# EasyEDA Pro project ProPrj_药盒0.11_2025-04-15.epro, board PCB_8266ex-20241025-smt_2025-03-07
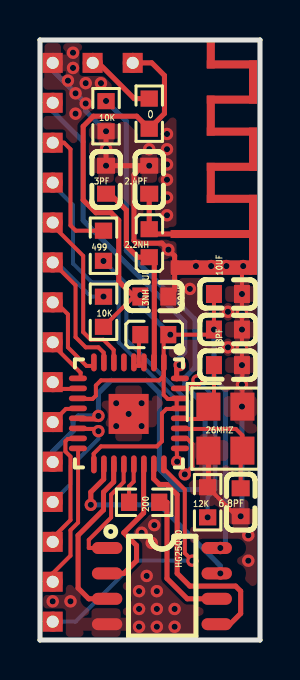
[diagram p5: board, top side]
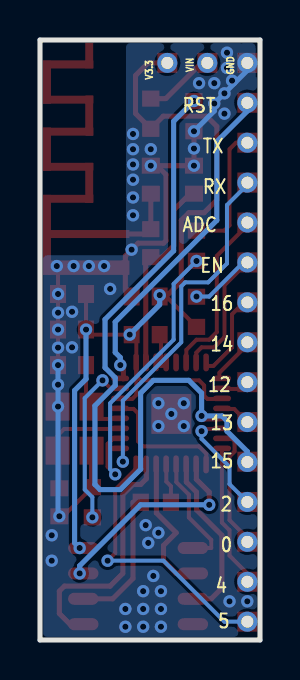
[diagram p6: board, bottom side, seen from below]

Outline 11 x 30 mm; copper layers: Top Layer, Bottom Layer. Coordinates in mm from the lower left corner of the outline.
Outline path: 0,30 11,30 11,0 0,0 0,30
Stack: Top Layer 0.035mm / Dielectric1 1.51mm FR4 er 4.5 / Bottom Layer 0.035mm

## Design rules (mm)
spacing safeClearance (default): track to track 0.152, other pairs 0.152 to 0.3
track width trackWidth (default): min 0.127, default 0.254, max 2.54
differential pair differentialPair (default): width min 0.127, default 0.254, max 2.54; gap min 0.152, default 0.152
via viaSize (default): diameter min 0.5, default 0.61, max 10; hole min 0.3, default 0.305, max 6
pour e73 uses gge48863
pour e346 uses gge48839

## Placement (name value [footprint] x y rotation side)
0  -  [R0603]  5.46 26.32 270 top
1UF  -  [C0603]  5.72 17.17 0 top
2.2NH  -  [IND-SMD_L1.6-W0.8-1]  5.46 19.84 270 top
2.4PF  -  [C0603]  5.46 23.02 270 top
3PF  -  [C0603]  3.3 23.02 270 top
4.3NH  -  [L0603]  5.72 15.27 0 top
6.8PF  -  [C0603]  9.4 13.74 0 top
6.8PF#2  -  [C0603]  10.03 6.89 270 top
10K  -  [R0603]  3.3 26.19 270 top
10K#2  -  [R0603]  3.17 16.41 270 top
10UF  -  [C0603]  9.4 17.3 0 top
12K  -  [R0603]  8.38 6.89 270 top
26MHZ  -  [CRYSTAL-SMD_4P-L3.2-W2.5-BL]  9.27 10.57 270 top
100NF  -  [C0603]  9.4 15.52 0 top
200  -  [R0603]  5.21 6.89 0 top
499  -  [R0603]  3.17 19.71 270 top
ANT2  -  [ANTENNA-2.4GHZ-MEANTRED]  6.73 19.46 270 top
HG25Q80  -  [SOP-8_L5.0-W3.9-P1.27-LS6.0-BL]  6.1 2.69 270 top
NOREF  -  [Pad_e367]  1.89 12.58 180 top
NOREF#2  -  [Pad_e541]  4.63 28.86 90 top
NOREF#3  -  [Pad_e335]  0.63 12.89 90 top
NOREF#4  -  [Pad_e539]  0.63 28.86 90 top
NOREF#5  -  [Pad_e331]  0.63 14.89 90 top
NOREF#6  -  [Pad_e373]  1.89 9.58 180 top
NOREF#7  -  [Pad_e342]  0.63 28.86 90 top
NOREF#8  -  [Pad_e377]  4.2 8.78 180 top
NOREF#9  -  [Pad_e380]  5.69 8.78 180 top
NOREF#10  -  [Pad_e525]  0.63 20.87 0 top
NOREF#11  -  [Pad_e343]  4.43 11.3 270 top
NOREF#12  -  [Pad_e341]  0.63 26.86 90 top
NOREF#13  -  [Pad_e368]  1.89 12.08 180 top
NOREF#14  -  [Pad_e340]  0.63 4.91 90 top
NOREF#15  -  [Pad_e339]  0.63 22.87 90 top
NOREF#16  -  [Pad_e330]  0.63 16.88 90 top
NOREF#17  -  [Pad_e378]  4.69 8.78 180 top
NOREF#18  -  [Pad_e527]  0.63 16.88 0 top
NOREF#19  -  [Pad_e361]  4.69 13.88 180 top
NOREF#20  -  [Pad_e376]  3.7 8.78 180 top
NOREF#21  -  [Pad_e534]  0.63 0.92 0 top
NOREF#22  -  [Pad_e383]  7 10.08 180 top
NOREF#23  -  [Pad_e365]  2.69 13.88 180 top
NOREF#24  -  [Pad_e538]  0.63 26.86 0 top
NOREF#25  -  [Pad_e382]  7 9.58 180 top
NOREF#26  -  [Pad_e328]  0.63 20.87 90 top
NOREF#27  -  [Pad_e344]  2.63 28.86 90 top
NOREF#28  -  [Pad_e360]  5.19 13.88 180 top
NOREF#29  -  [Pad_e535]  0.63 24.87 0 top
NOREF#30  -  [Pad_e357]  7 13.08 180 top
NOREF#31  -  [Pad_e387]  7 12.08 180 top
NOREF#32  -  [Pad_e336]  0.63 2.91 90 top
NOREF#33  -  [Pad_e532]  0.63 12.89 0 top
NOREF#34  -  [Pad_e345]  4.63 28.86 90 top
NOREF#35  -  [Pad_e386]  7 11.58 180 top
NOREF#36  -  [Pad_e369]  1.89 11.58 180 top
NOREF#37  -  [Pad_e358]  6.19 13.88 180 top
NOREF#38  -  [Pad_e528]  0.63 14.89 0 top
NOREF#39  -  [Pad_e333]  0.63 8.92 90 top
NOREF#40  -  [Pad_e374]  2.69 8.78 180 top
NOREF#41  -  [Pad_e338]  0.63 24.87 90 top
NOREF#42  -  [Pad_e329]  0.63 18.88 90 top
NOREF#43  -  [Pad_e384]  7 10.58 180 top
NOREF#44  -  [Pad_e533]  0.63 2.91 0 top
NOREF#45  -  [Pad_e364]  3.2 13.88 180 top
NOREF#46  -  [Pad_e372]  1.89 10.08 180 top
NOREF#47  -  [Pad_e388]  7 12.58 180 top
NOREF#48  -  [Pad_e332]  0.63 6.9 90 top
NOREF#49  -  [Pad_e334]  0.63 10.9 90 top
NOREF#50  -  [Pad_e371]  1.89 10.58 180 top
NOREF#51  -  [Pad_e366]  1.89 13.08 180 top
NOREF#52  -  [Pad_e536]  0.63 22.87 0 top
NOREF#53  -  [Pad_e385]  7 11.08 180 top
NOREF#54  -  [Pad_e530]  0.63 8.9 0 top
NOREF#55  -  [Pad_e362]  4.2 13.88 180 top
NOREF#56  -  [Pad_e529]  0.63 6.9 0 top
NOREF#57  -  [Pad_e337]  0.63 0.92 90 top
NOREF#58  -  [Pad_e537]  0.63 4.91 0 top
NOREF#59  -  [Pad_e381]  6.19 8.78 180 top
NOREF#60  -  [Pad_e363]  3.7 13.88 180 top
NOREF#61  -  [Pad_e375]  3.2 8.78 180 top
NOREF#62  -  [Pad_e526]  0.63 18.88 0 top
NOREF#63  -  [Pad_e531]  0.63 10.9 0 top
NOREF#64  -  [Pad_e540]  2.63 28.86 90 top
NOREF#65  -  [Pad_e370]  1.89 11.08 180 top
NOREF#66  -  [Pad_e359]  5.69 13.88 180 top
NOREF#67  -  [Pad_e379]  5.19 8.78 180 top

## Footprints (pads in the part's own frame, mm; a bottom-side part is the same pattern mirrored in y, then rotated)
ANTENNA-2.4GHZ-MEANTRED
  rect 0.4x0.4 smd: 1(-0.84,0)
  rect 0.72x0.4 smd: 2(0.84,0)
C0603
  rect 0.8x0.9 smd: 1(-0.7,0) 2(0.7,0)
CRYSTAL-SMD_4P-L3.2-W2.5-BL
  rect 1.4x1.2 smd: 1(-1.1,-0.85) 2(1.1,-0.85) 3(1.1,0.85) 4(-1.1,0.85)
IND-SMD_L1.6-W0.8-1
  rect 0.8x0.864 smd: 1(0.7,0) 2(-0.7,0)
L0603
  rect 0.8x0.864 smd: 1(-0.7,0) 2(0.7,0)
Pad_e328
  rect 1x1 smd: 1(0,0)
Pad_e329
  rect 1x1 smd: 1(0,0)
Pad_e330
  rect 1x1 smd: 1(0,0)
Pad_e331
  rect 1x1 smd: 1(0,0)
Pad_e332
  rect 1x1 smd: 1(0,0)
Pad_e333
  rect 1x1 smd: 1(0,0)
Pad_e334
  rect 1x1 smd: 1(0,0)
Pad_e335
  rect 1x1 smd: 1(0,0)
Pad_e336
  rect 1x1 smd: 1(0,0)
Pad_e337
  rect 1x1 smd: 1(0,0)
Pad_e338
  rect 1x1 smd: 1(0,0)
Pad_e339
  rect 1x1 smd: 1(0,0)
Pad_e340
  rect 1x1 smd: 1(0,0)
Pad_e341
  rect 1x1 smd: 1(0,0)
Pad_e342
  rect 1x1 smd: 1(0,0)
Pad_e343
  rect 2x2 smd: 33(0,0)
Pad_e344
  rect 1x1 smd: 1(0,0)
Pad_e345
  rect 1x1 smd: 1(0,0)
Pad_e357
  oval 0.9x0.28 smd: 32(0,0)
Pad_e358
  oval 0.28x0.9 smd: 1(0,0)
Pad_e359
  oval 0.28x0.9 smd: 2(0,0)
Pad_e360
  oval 0.28x0.9 smd: 3(0,0)
Pad_e361
  oval 0.28x0.9 smd: 4(0,0)
Pad_e362
  oval 0.28x0.9 smd: 5(0,0)
Pad_e363
  oval 0.28x0.9 smd: 6(0,0)
Pad_e364
  oval 0.28x0.9 smd: 7(0,0)
Pad_e365
  oval 0.28x0.9 smd: 8(0,0)
Pad_e366
  oval 0.9x0.28 smd: 9(0,0)
Pad_e367
  oval 0.9x0.28 smd: 10(0,0)
Pad_e368
  oval 0.9x0.28 smd: 11(0,0)
Pad_e369
  oval 0.9x0.28 smd: 12(0,0)
Pad_e370
  oval 0.9x0.28 smd: 13(0,0)
Pad_e371
  oval 0.9x0.28 smd: 14(0,0)
Pad_e372
  oval 0.9x0.28 smd: 15(0,0)
Pad_e373
  oval 0.9x0.28 smd: 16(0,0)
Pad_e374
  oval 0.28x0.9 smd: 17(0,0)
Pad_e375
  oval 0.28x0.9 smd: 18(0,0)
Pad_e376
  oval 0.28x0.9 smd: 19(0,0)
Pad_e377
  oval 0.28x0.9 smd: 20(0,0)
Pad_e378
  oval 0.28x0.9 smd: 21(0,0)
Pad_e379
  oval 0.28x0.9 smd: 22(0,0)
Pad_e380
  oval 0.28x0.9 smd: 23(0,0)
Pad_e381
  oval 0.28x0.9 smd: 24(0,0)
Pad_e382
  oval 0.9x0.28 smd: 25(0,0)
Pad_e383
  oval 0.9x0.28 smd: 26(0,0)
Pad_e384
  oval 0.9x0.28 smd: 27(0,0)
Pad_e385
  oval 0.9x0.28 smd: 28(0,0)
Pad_e386
  oval 0.9x0.28 smd: 29(0,0)
Pad_e387
  oval 0.9x0.28 smd: 30(0,0)
Pad_e388
  oval 0.9x0.28 smd: 31(0,0)
Pad_e525
  round 1 hole 0.6: 1(0,0)
Pad_e526
  round 1 hole 0.6: 1(0,0)
Pad_e527
  round 1 hole 0.6: 1(0,0)
Pad_e528
  round 1 hole 0.6: 1(0,0)
Pad_e529
  round 1 hole 0.6: 1(0,0)
Pad_e530
  round 1 hole 0.6: 1(0,0)
Pad_e531
  round 1 hole 0.6: 1(0,0)
Pad_e532
  round 1 hole 0.6: 1(0,0)
Pad_e533
  round 1 hole 0.6: 1(0,0)
Pad_e534
  round 1 hole 0.6: 1(0,0)
Pad_e535
  round 1 hole 0.6: 1(0,0)
Pad_e536
  round 1 hole 0.6: 1(0,0)
Pad_e537
  round 1 hole 0.6: 1(0,0)
Pad_e538
  round 1 hole 0.6: 1(0,0)
Pad_e539
  round 1 hole 0.6: 1(0,0)
Pad_e540
  round 1 hole 0.6: 1(0,0)
Pad_e541
  round 1 hole 0.6: 1(0,0)
R0603
  rect 0.806x0.864 smd: 1(-0.753,0) 2(0.753,0)
SOP-8_L5.0-W3.9-P1.27-LS6.0-BL
  oval 0.6x1.52 smd: 1(-1.905,-2.74) 2(-0.635,-2.74) 3(0.635,-2.74) 4(1.905,-2.74) 5(1.905,2.74) 6(0.635,2.74) 7(-0.635,2.74) 8(-1.905,2.74)

## Nets
GND: 1UF.2 2.4PF.1 3PF.1 6.8PF.2 6.8PF#2.2 10K.2 10UF.2 12K.1 26MHZ.2 26MHZ.4 100NF.2 ANT2.2 HG25Q80.4 NOREF#4.1 NOREF#7.1 NOREF#11.33
V3: 0.2 1UF.1 4.3NH.2 10K#2.2 10UF.1 100NF.1 HG25Q80.8 NOREF#2.1 NOREF#13.11 NOREF#31.30 NOREF#34.1 NOREF#35.29 NOREF#37.1 NOREF#40.17
VIN: 0.1 NOREF#27.1 NOREF#64.1
2: 2.2NH.1 3PF.2
3: 4.3NH.1 NOREF#19.4
20SCS: HG25Q80.1 NOREF#8.20
21: 200.1
26: 499.2
27: 6.8PF#2.1 26MHZ.3
28: 6.8PF.1 26MHZ.1
31: 12K.2 NOREF#47.31
ADC: NOREF#10.1 NOREF#26.1 NOREF#60.6
ANT: 2.2NH.2 2.4PF.2 ANT2.1
D: NOREF#67.22
D0: HG25Q80.2
D1: HG25Q80.5 NOREF#9.23
EN: 10K#2.1 NOREF#42.1 NOREF#45.7 NOREF#62.1
GPIO0: NOREF#14.1 NOREF#46.15 NOREF#58.1
GPIO2: NOREF#48.1 NOREF#50.14 NOREF#56.1
GPIO4: NOREF#6.16 NOREF#32.1 NOREF#44.1
GPIO5: NOREF#21.1 NOREF#57.1 NOREF#59.24
GPIO9: HG25Q80.7 NOREF#61.18
GPIO10: HG25Q80.3 NOREF#20.19
GPIO12: NOREF.10 NOREF#3.1 NOREF#33.1
GPIO13: NOREF#36.12 NOREF#49.1 NOREF#63.1
GPIO14: NOREF#5.1 NOREF#38.1 NOREF#51.9
GPIO15: 10K.1 NOREF#39.1 NOREF#54.1 NOREF#65.13
GPIO16: NOREF#16.1 NOREF#18.1 NOREF#23.8
NRST: NOREF#12.1 NOREF#24.1 NOREF#30.32
RX: NOREF#15.1 NOREF#25.25 NOREF#52.1
SCLK: 200.2 HG25Q80.6
TX: 499.1 NOREF#29.1 NOREF#41.1

Pads without a net: NOREF#17 21; NOREF#22 26; NOREF#28 3; NOREF#43 27; NOREF#53 28; NOREF#55 5; NOREF#66 2

## Via types
v1: diameter 0.62, hole 0.31, Top Layer to Bottom Layer, 73 vias

## Routing (per net, layer and track width the routed paths; a pad name or vN(x,y) marks a point on that pad's centre or on a via; arc(x,y) is an arc through that point)
GND: length 40
  Top Layer w0.2: v1(10.03,6.19) 9.84,6.19 12K.1 ; v1(10.1,17.3) 10.1,18.38 9.86,18.62 ANT2.2 ; v1(10.1,17.3) v1(10.1,16.36) ; v1(10.1,17.3) v1(10.1,15.52) v1(10.1,14.62) v1(10.1,13.74) 10.12,13.72 26MHZ.4
  Top Layer w0.254: v1(5.46,23.72) v1(3.3,23.72) v1(3.3,24.57) v1(3.3,25.44) ; 12K.1 8.42,7.68 26MHZ.2 ; 5.46,23.72 5.15,23.72 4.7,23.27 4.7,19.97 4.83,19.84 6.1,19.84 v1(6.42,19.52) 6.73,19.2 ANT2.2 6.73,17.49 1UF.2
  Bottom Layer w0.254: v1(10.1,13.74) v1(10.1,12.77) 10.1,6.25 v1(10.03,6.19) ; 10K.2 2.29,26.45 v1(2.29,26.83) 0.63,28.48 NOREF#4.1
  vias: v1(0.63,1.93) v1(1.4,27.97) v1(1.52,1.93) v1(1.65,29.36) v1(1.65,28.6) v1(1.78,27.33) v1(1.78,26.32) v1(2.29,27.84) v1(3.05,27.84) v1(3.81,11.84) v1(3.81,10.7) v1(4.43,11.3) v1(4.95,2.44) v1(4.95,1.55) v1(4.95,0.66) v1(5.08,11.84) v1(5.08,10.7) v1(5.08,5.36) v1(5.33,3.2) v1(5.46,24.54) v1(5.59,4.85) v1(5.72,5.74) v1(5.84,2.44) v1(5.84,1.55) v1(5.84,0.66) v1(6.35,25.3) v1(6.35,24.54) v1(6.35,23.78) v1(6.35,23.02) v1(6.35,22.13) v1(6.35,21.24) v1(6.73,1.55) v1(6.73,0.66) v1(7.49,17.55) v1(7.8,18.7) v1(8.56,18.7) v1(9.32,18.7) v1(9.4,16.41) v1(9.4,14.63) v1(10.1,11.67) v1(10.16,18.7) v1(10.41,5.23) v1(10.41,3.97)
V3: length 55.6
  Top Layer w0.2: 6.83,12.05 6.39,12.05 6.18,12.26 6.18,13.7 ; 6.83,12.05 6.83,11.55 6.32,11.55 6.1,11.33 6.1,9.93 5.84,9.68 3.05,9.68 2.68,9.31 2.68,8.9 ; 6.18,13.7 6.18,14.94 v1(6.51,15.27) 8.44,15.27 v1(8.7,15.52) 10UF.1 ; 6.18,13.7 6.18,13.2 5.97,12.98 3.05,12.98 2.79,12.73 2.79,12.22 2.63,12.05 2.03,12.05 ; 1UF.1 4.69,17.17 10K#2.2
  Top Layer w0.254: 0.2 4.83,26.19 2.67,26.19 2.16,25.68 2.16,22 2.79,21.36 3.56,21.36 3.94,20.98 3.94,17.94 4.7,17.17 1UF.1 ; 0.2 6.22,26.33 6.22,28.22 5.59,28.86 NOREF#2.1 ; 0.2 5.46,25.44
  Bottom Layer w0.254: v1(9.02,4.6) 9.27,4.85 9.27,12.47 8.7,13.05 8.7,15.52 ; 5.02,17.24 5.02,16.77 v1(6.51,15.27)
  vias: v1(5.01,17.24)
VIN: length 3.6
  Top Layer w0.254: 0.1 4.71,27.07 2.92,28.86 2.63,28.86
2: length 10.3
  Top Layer w0.254: 5.72,13.62 5.72,19.14 2.2NH.1 4.89,19.14 4.32,19.71 4.32,21.49 3.49,22.32 3.3,22.32
3: length 2.1
  Top Layer w0.2: 4.68,13.7 5.19,13.72 ; 4.91,15.27 4.95,15.27 4.95,13.71
20SCS: length 5.9
  Top Layer w0.2: 3.3,4.6 2.44,4.6 2.44,5.01 3.56,6.12 3.56,7.27 4.18,7.89 4.18,8.9
21: length 2.1
  Top Layer w0.2: 4.68,8.9 4.68,7.92 4.45,7.69 200.1
26: length 15.1
  Top Layer w0.2: v1(7.24,8.28) 7.62,8.66 7.62,9.81 7.37,10.05 6.83,10.05
  Bottom Layer w0.2: v1(7.24,8.28) 7.49,8.54 7.49,11.84 4.32,15.01 4.32,17.81 v1(3.17,18.95)
27: length 6.2
  Top Layer w0.2: 6.83,10.55 9.79,10.55 10.12,10.23 26MHZ.3 ; 26MHZ.3 10.12,9.47 10.17,9.47 ; 26MHZ.3 10.03,9.38 6.8PF#2.1
28: length 4.4
  Top Layer w0.2: 6.83,11.05 8.1,11.05 8.42,11.37 26MHZ.1 8.7,11.67 8.7,13.74
31: length 8.6
  Top Layer w0.2: v1(7.87,12.98) 7.45,12.55 6.83,12.55
  Bottom Layer w0.2: v1(7.87,12.98) 8.76,12.09 8.76,7.52 8.38,7.14 12K.2
  vias: v1(8.38,6.13)
ADC: length 8.8
  Top Layer w0.2: NOREF#10.1 0.63,20.73 2.16,19.2 2.16,15.39 2.54,15.01 3.17,15.01 3.68,14.51 3.68,13.7
ANT: length 3.1
  Top Layer w0.254: 2.4PF.2 2.2NH.2 5.7,20.3 ANT2.1
D0: length 7.4
  Top Layer w0.254: 5.18,8.9 5.18,6.35 4.19,5.36 4.83,4.73 4.83,3.97 4.19,3.33 3.3,3.33
D1: length 12.2
  Top Layer w0.254: 5.68,8.9 5.68,8.06 5.97,7.78 6.35,7.78 6.86,7.27 6.86,3.33 7.49,2.69 9.78,2.69 10.03,2.44 10.03,1.32 9.5,0.79 9.02,0.79
EN: length 10.1
  Top Layer w0.2: 3.18,13.7 3.18,14.37 2.92,14.63 2.29,14.63 1.78,15.14 1.78,17.73 NOREF#42.1
  Bottom Layer w0.2: v1(3.17,17.17) 2.54,17.17 0.63,19.08 NOREF#42.1
GPIO0: length 6.3
  Top Layer w0.2: 0.63,4.91 0.63,5.11 1.52,6 1.52,9.17 1.27,9.43 1.27,9.93 1.39,10.05 2.03,10.05
GPIO2: length 5.4
  Top Layer w0.2: v1(2.92,10.44) 2.79,10.44 2.68,10.55 2.03,10.55
  Bottom Layer w0.2: v1(2.92,10.44) 2.92,10.06 1.52,8.66 1.52,7.79 NOREF#48.1
GPIO4: length 7.3
  Top Layer w0.2: NOREF#32.1 0.63,3.33 1.52,4.22 1.52,5.49 1.91,5.87 1.91,9.55 2.03,9.55
GPIO5: length 13.8
  Top Layer w0.2: 6.18,8.9 6.18,8.58 7.24,7.52 7.24,4.35 v1(7.62,3.97)
  Bottom Layer w0.2: v1(7.62,3.97) 4.83,3.97 1.78,0.92 NOREF#21.1
GPIO9: length 10.5
  Top Layer w0.254: 3.18,8.9 3.18,8.04 2.54,7.39 v1(2.54,6.76)
  Bottom Layer w0.254: v1(9.02,3.33) 9.02,3.71 5.97,6.76 v1(2.54,6.76)
GPIO10: length 8.7
  Top Layer w0.254: 3.68,8.9 3.68,7.9 3.17,7.39 3.17,6.5 1.91,5.23 1.91,2.59 2.44,2.06 3.3,2.06
GPIO12: length 1.5
  Top Layer w0.2: 0.63,12.89 0.97,12.55 2.03,12.55
GPIO13: length 1.7
  Top Layer w0.2: NOREF#49.1 1.29,11.55 2.03,11.55
GPIO14: length 2.4
  Top Layer w0.2: NOREF#5.1 0.63,14.76 2.03,13.36 2.03,13.05
GPIO15: length 37.8
  Top Layer w0.254: v1(2.92,11.2) 2.77,11.05 2.03,11.05
  Bottom Layer w0.254: v1(3.3,26.95) 4.32,25.94 4.32,19.46 7.75,16.03 7.75,13.62 7.24,13.11 7.24,12.73 8.25,11.71 8.25,7.78 8,7.52 6.98,7.52 5.97,8.54 5.97,12.35 5.33,12.98 3.56,12.98 2.92,12.35 v1(2.92,11.2) 1.91,11.2 1.65,10.95 1.65,10.44 0.63,9.43 NOREF#54.1
GPIO16: length 4.3
  Top Layer w0.2: 2.68,13.7 2.33,13.7 1.4,14.63 1.4,16.28 0.8,16.88 0.63,16.88
NRST: length 16.7
  Top Layer w0.254: 6.83,13.05 6.83,13.59 v1(6.98,13.74)
  Bottom Layer w0.254: v1(6.98,13.74) 6.98,14.12 7.24,14.38 7.24,15.9 2.16,20.98 2.16,24.92 0.63,26.44 0.63,26.86
RX: length 17.8
  Top Layer w0.2: 6.83,9.55 v1(6.86,8.92)
  Bottom Layer w0.2: v1(6.86,8.92) 6.86,11.97 3.94,14.89 3.94,17.68 3.73,17.88 2.59,17.88 1.65,18.82 1.65,21.75 0.63,22.76 NOREF#15.1
SCLK: length 7.3
  Top Layer w0.254: 9.02,2.06 7.37,2.06 6.35,3.08 6.35,6.89 200.2
TX: length 6.6
  Top Layer w0.2: 499.1 1.79,20.47 1.52,20.73 1.52,24.54 1.2,24.87 NOREF#29.1

## Copper pours and planes (outline as drawn; the poured copper is in the pictures)
GND on Top Layer: -1.91,33.3 -1.91,27.46 -7.75,21.62 -7.75,-2.51 -5.21,-5.05 21.59,-5.05 23.5,-6.96 23.5,35.21 11.94,46.76
GND on Bottom Layer: 7.24,42.57 -0.89,42.57 -27.69,15.78 -27.69,0.28 -11.3,-16.1 17.53,-16.1 25.65,-7.97 25.65,30.51 16.76,39.4

## Text on the board
Bottom Silkscreen Layer: GND | VIN | V3.3 | 2 | 0 | 5 | 4 | 16 | 14 | 13 | 15 | 12 | TX | RX | EN | RST | ADC
